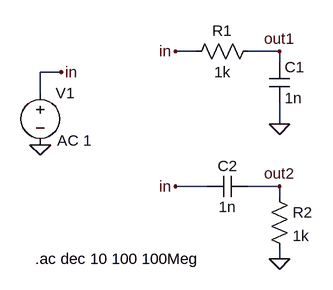
[diagram p0: schematic RC.asc]
RC.asc, the LTspice schematic file:
Version 4
SHEET 1 880 680
WIRE 32 128 0 128
WIRE 160 128 112 128
WIRE 160 144 160 128
WIRE -176 160 -208 160
WIRE -208 192 -208 160
WIRE 160 240 160 208
WIRE 48 336 0 336
WIRE 160 336 112 336
WIRE 160 352 160 336
WIRE 160 448 160 432
FLAG 160 448 0
FLAG 160 240 0
FLAG 0 336 in
FLAG 0 128 in
FLAG -208 272 0
FLAG -176 160 in
FLAG 160 336 out2
FLAG 160 128 out1
SYMBOL res 144 336 R0
SYMATTR InstName R2
SYMATTR Value 1k
SYMBOL res 128 112 R90
WINDOW 0 0 56 VBottom 2
WINDOW 3 32 56 VTop 2
SYMATTR InstName R1
SYMATTR Value 1k
SYMBOL cap 144 144 R0
SYMATTR InstName C1
SYMATTR Value 1n
SYMBOL cap 112 320 R90
WINDOW 0 0 32 VBottom 2
WINDOW 3 32 32 VTop 2
SYMATTR InstName C2
SYMATTR Value 1n
SYMBOL voltage -208 176 R0
WINDOW 123 26 89 Left 2
WINDOW 39 0 0 Left 0
SYMATTR InstName V1
SYMATTR Value ""
SYMATTR Value2 AC 1
TEXT -216 448 Left 2 !.ac dec 10 100 100Meg

The netlist it stands for:
* RC.asc
R2 out2 0 1k
R1 out1 in 1k
C1 out1 0 1n
C2 out2 in 1n
V1 in 0 AC 1
.ac dec 10 100 100Meg
.backanno
.end